# EAGLE design base_drive (EAGLE 9.5.0)
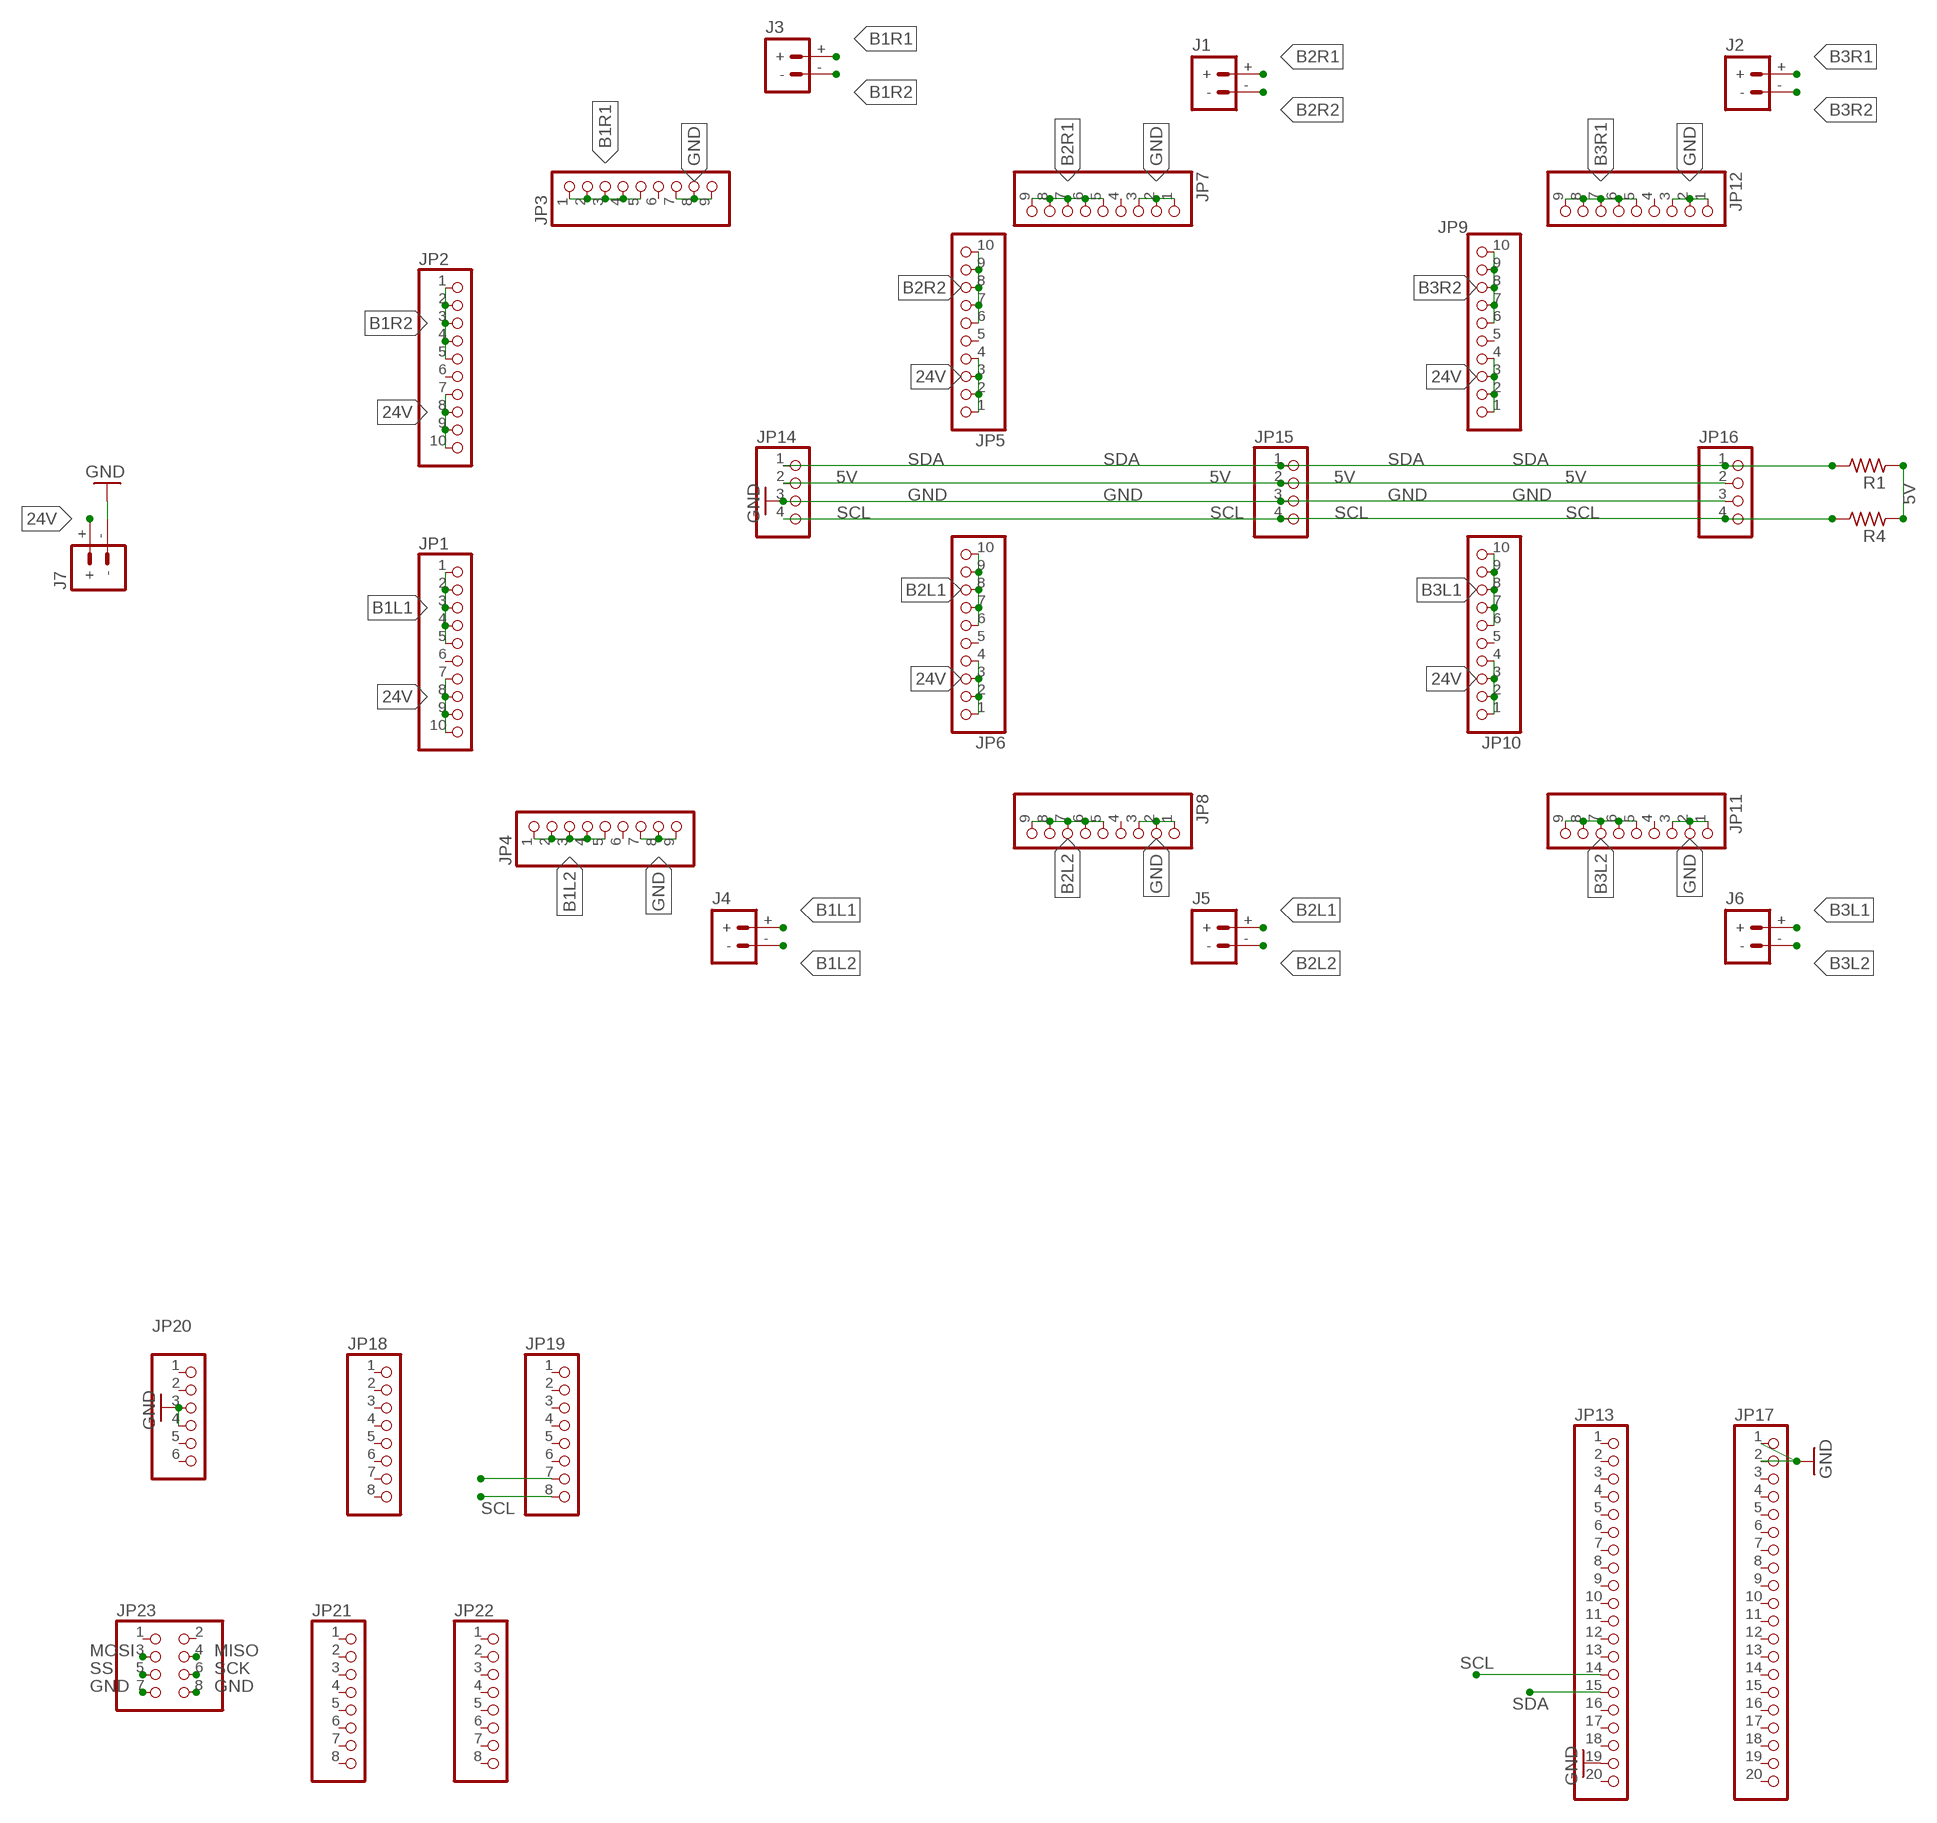
[diagram p0: schematic, sheet 1, part 1 of 2]
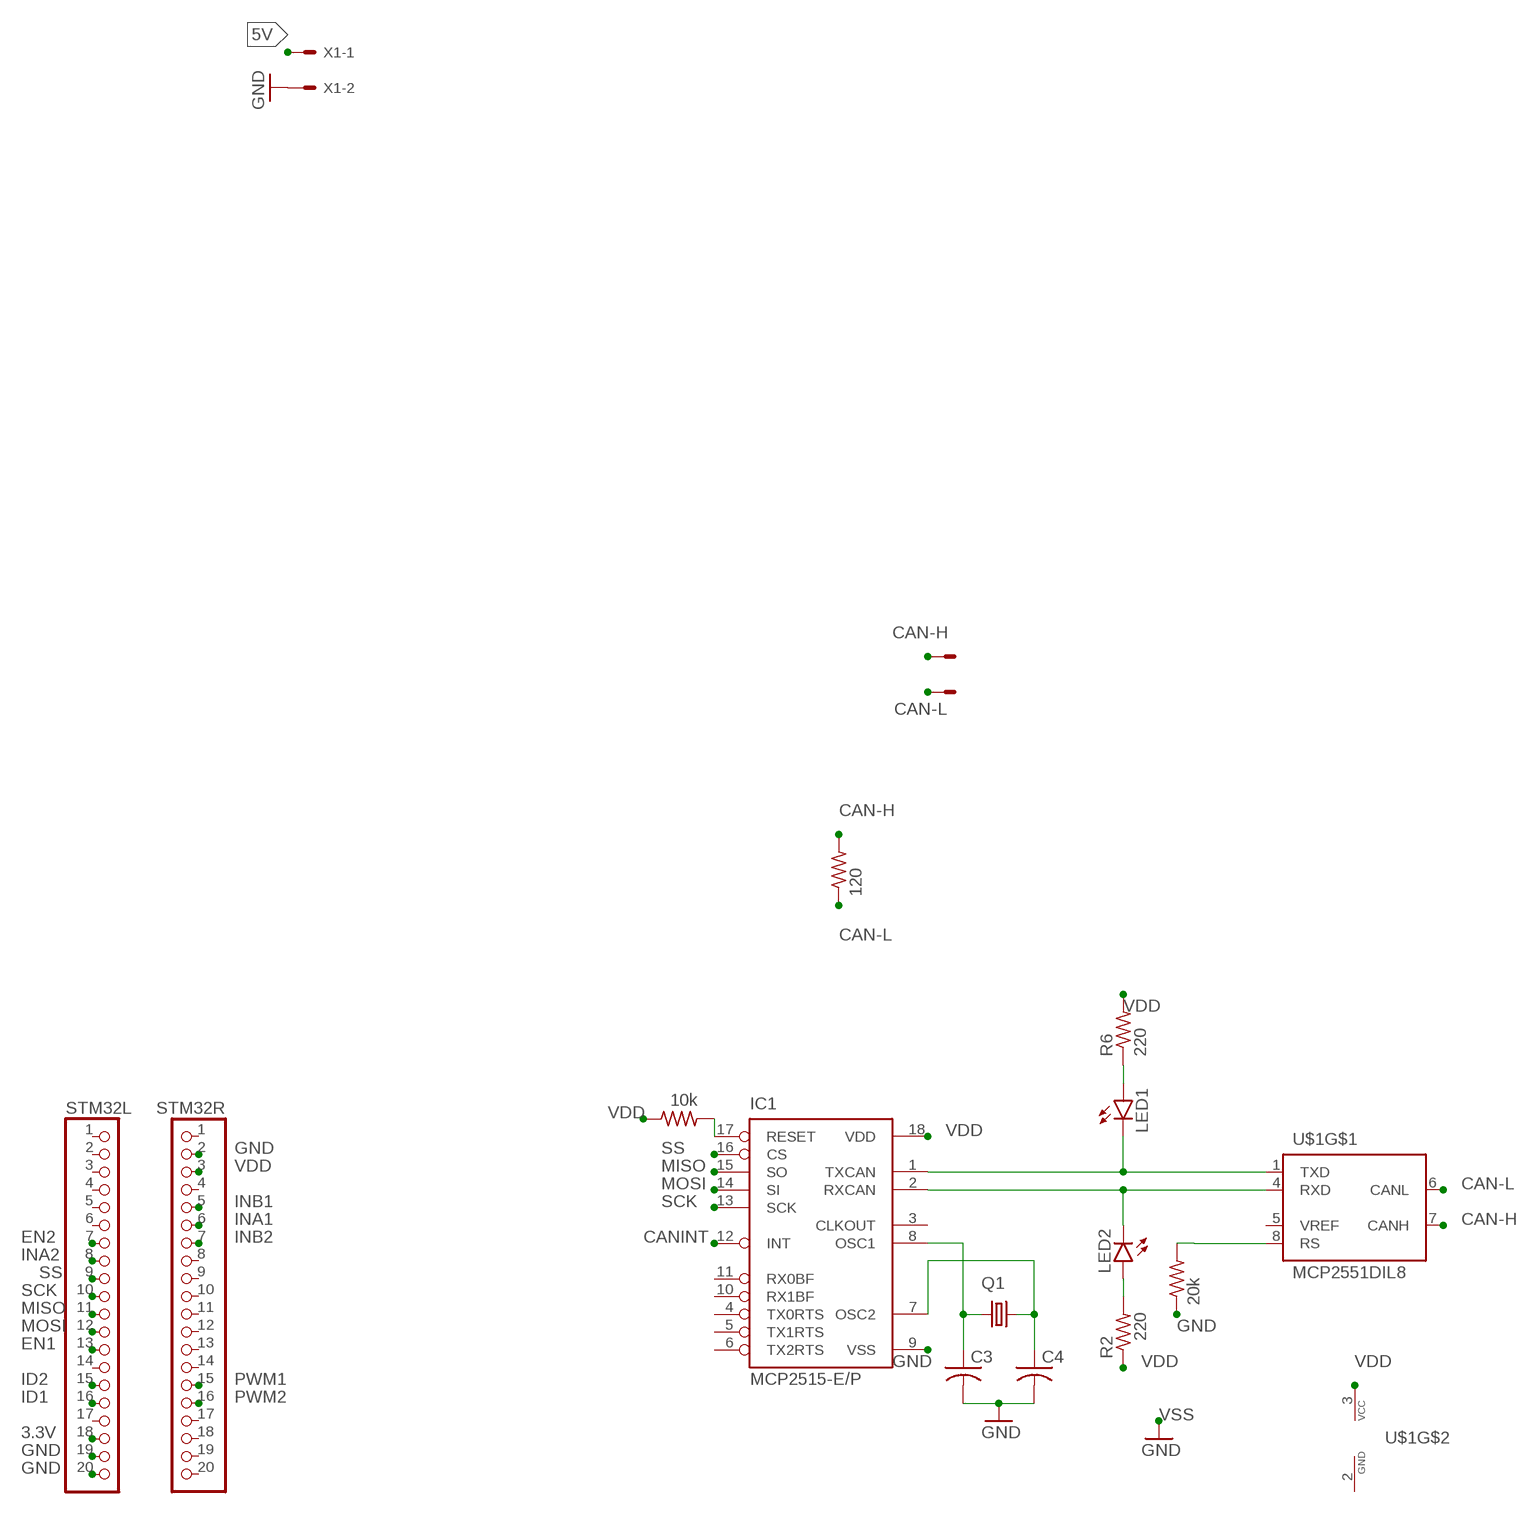
[diagram p1: schematic, sheet 1, part 2 of 2]

## Parts
C3  C-US025-024X044  [C025-024X044]
C4  C-US025-024X044  [C025-024X044]
IC1  MCP2515-E/P  [DIL18]
J1  BATTERY_CONN_DEANS  [DEANS]
J2  BATTERY_CONN_DEANS  [DEANS]
J3  BATTERY_CONN_DEANS  [DEANS]
J4  BATTERY_CONN_DEANS  [DEANS]
J5  BATTERY_CONN_DEANS  [DEANS]
J6  BATTERY_CONN_DEANS  [DEANS]
J7  BATTERY_CONN_DEANS  [DEANS]
JP1  PINHD-1X10  [1X10]
JP2  PINHD-1X10  [1X10]
JP3  PINHD-1X9  [1X09]
JP4  PINHD-1X9  [1X09]
JP5  PINHD-1X10  [1X10]
JP6  PINHD-1X10  [1X10]
JP7  PINHD-1X9  [1X09]
JP8  PINHD-1X9  [1X09]
JP9  PINHD-1X10  [1X10]
JP10  PINHD-1X10  [1X10]
JP11  PINHD-1X9  [1X09]
JP12  PINHD-1X9  [1X09]
JP13  PINHD-1X20  [1X20]
JP14  PINHD-1X4  [1X04]
JP15  PINHD-1X4  [1X04]
JP16  PINHD-1X4  [1X04]
JP17  PINHD-1X20  [1X20]
JP18  PINHD-1X8  [1X08]
JP19  PINHD-1X8  [1X08]
JP20  PINHD-1X6  [1X06]
JP21  PINHD-1X8  [1X08]
JP22  PINHD-1X8  [1X08]
JP23  PINHD-2X4  [2X04]
LED1  LEDSMT1206  [1206]
LED2  LEDSMT1206  [1206]
Q1  CRYSTALHC49U-V  [HC49U-V]
R1  R_1206  [R1206]
R2  220  R-US_R0805  [R0805]
R3  120  R-US_0207/9  [0207/9]
R4  R_1206  [R1206]
R6  220  R-US_R0805  [R0805]
R39  10k  R-US_0207/10  [0207/10]
R40  20k  R-US_0207/10  [0207/10]
STM32L  PINHD-1X20  [1X20]
STM32R  PINHD-1X20  [1X20]
U$1  MCP2551DIL8  [DIL08]
X1  KK-156-2  [KK-156-2]
X2  KK-156-2  [KK-156-2]

## Nets
3.3V: STM32L.18
5V: JP14.2 JP15.2 JP16.2 R1.1 R4.1 X1.1
24V: J7.+ JP1.7 JP1.8 JP1.9 JP1.10 JP2.7 JP2.8 JP2.9 JP2.10 JP5.1 JP5.2 JP5.3 JP5.4 JP6.1 JP6.2 JP6.3 JP6.4 JP9.1 JP9.2 JP9.3 JP9.4 JP10.1 JP10.2 JP10.3 JP10.4
B1L1: J4.+ JP1.1 JP1.2 JP1.3 JP1.4 JP1.5
B1L2: J4.- JP4.1 JP4.2 JP4.3 JP4.4 JP4.5
B1R1: J3.+ JP3.1 JP3.2 JP3.3 JP3.4 JP3.5
B1R2: J3.- JP2.1 JP2.2 JP2.3 JP2.4 JP2.5
B2L1: J5.+ JP6.6 JP6.7 JP6.8 JP6.9 JP6.10
B2L2: J5.- JP8.5 JP8.6 JP8.7 JP8.8 JP8.9
B2R1: J1.+ JP7.5 JP7.6 JP7.7 JP7.8 JP7.9
B2R2: J1.- JP5.6 JP5.7 JP5.8 JP5.9 JP5.10
B3L1: J6.+ JP10.6 JP10.7 JP10.8 JP10.9 JP10.10
B3L2: J6.- JP11.5 JP11.6 JP11.7 JP11.8 JP11.9
B3R1: J2.+ JP12.5 JP12.6 JP12.7 JP12.8 JP12.9
B3R2: J2.- JP9.6 JP9.7 JP9.8 JP9.9 JP9.10
CAN-H: R3.2 U$1.7(CANH) X2.1
CAN-L: R3.1 U$1.6(CANL) X2.2
CANINT: IC1.12(INT)
EN1: STM32L.13
EN2: STM32L.7
GND: C3.2 C4.2 IC1.9(VSS) J7.- JP3.7 JP3.8 JP3.9 JP4.7 JP4.8 JP4.9 JP7.1 JP7.2 JP7.3 JP8.1 JP8.2 JP8.3 JP11.1 JP11.2 JP11.3 JP12.1 JP12.2 JP12.3 JP13.19 JP14.3 JP15.3 JP16.3 JP17.1 JP17.2 JP20.3 JP20.4 JP23.7 JP23.8 R40.1 STM32L.19 STM32L.20 STM32R.2 X1.2
ID1: STM32L.16
ID2: STM32L.15
INA1: STM32R.6
INA2: STM32L.8
INB1: STM32R.5
INB2: STM32R.7
MISO: IC1.15(SO) JP23.4 STM32L.11
MOSI: IC1.14(SI) JP23.3 STM32L.12
N$1: IC1.1(TXCAN) LED1.C U$1.1(TXD)
N$2: R40.2 U$1.8(RS)
N$3: C4.1 IC1.7(OSC2) Q1.2
N$4: C3.1 IC1.8(OSC1) Q1.1
N$9: IC1.17(RESET) R39.2
N$29: LED2.A R2.2
N$37: LED1.A R6.1
N$38: IC1.2(RXCAN) LED2.C U$1.4(RXD)
PWM1: STM32R.15
PWM2: STM32R.16
SCK: IC1.13(SCK) JP23.6 STM32L.10
SCL: JP13.14 JP14.4 JP15.4 JP16.4 JP19.8 R4.2
SDA: JP13.15 JP14.1 JP15.1 JP16.1 JP19.7 R1.2
SS: IC1.16(CS) JP23.5 STM32L.9
VDD: IC1.18(VDD) R2.1 R6.2 R39.1 STM32R.3 U$1.3(VCC)
Unconnected: IC1.3(CLKOUT) IC1.4(TX0RTS) IC1.5(TX1RTS) IC1.6(TX2RTS) IC1.10(RX1BF) IC1.11(RX0BF) JP1.6 JP2.6 JP3.6 JP4.6 JP5.5 JP6.5 JP7.4 JP8.4 JP9.5 JP10.5 JP11.4 JP12.4 JP13.1 JP13.2 JP13.3 JP13.4 JP13.5 JP13.6 JP13.7 JP13.8 JP13.9 JP13.10 JP13.11 JP13.12 JP13.13 JP13.16 JP13.17 JP13.18 JP13.20 JP17.3 JP17.4 JP17.5 JP17.6 JP17.7 JP17.8 JP17.9 JP17.10 JP17.11 JP17.12 JP17.13 JP17.14 JP17.15 JP17.16 JP17.17 JP17.18 JP17.19 JP17.20 JP18.1 JP18.2 JP18.3 JP18.4 JP18.5 JP18.6 JP18.7 JP18.8 JP19.1 JP19.2 JP19.3 JP19.4 JP19.5 JP19.6 JP20.1 JP20.2 JP20.5 JP20.6 JP21.1 JP21.2 JP21.3 JP21.4 JP21.5 JP21.6 JP21.7 JP21.8 JP22.1 JP22.2 JP22.3 JP22.4 JP22.5 JP22.6 JP22.7 JP22.8 JP23.1 JP23.2 STM32L.1 STM32L.2 STM32L.3 STM32L.4 STM32L.5 STM32L.6 STM32L.14 STM32L.17 STM32R.1 STM32R.4 STM32R.8 STM32R.9 STM32R.10 STM32R.11 STM32R.12 STM32R.13 STM32R.14 STM32R.17 STM32R.18 STM32R.19 STM32R.20 U$1.5(VREF)

## Power pins joined to a net without a drawn wire
GND: U$1.2(GND)

## Library data of the parts
C3 C4 = adafruit:C-US: CAPACITOR, American symbol
IC1 = mcp2515:MCP2515
J1-J7 = SparkFun-Connectors:BATTERY_CONN: Battery Connectors Various footprints for battery connections SparkFun Products: Deans Connector -M/F Pair <https://www.sparkfun.com/products/11864>; SF_ID: PRT-11864
JP1 JP2 JP5 JP6 JP9 JP10 = pinhead:PINHD-1X10: PIN HEADER
JP3 JP4 JP7 JP8 JP11 JP12 = pinhead:PINHD-1X9: PIN HEADER
JP13 JP17 = pinhead:PINHD-1X20: PIN HEADER
JP14-JP16 = pinhead:PINHD-1X4: PIN HEADER
JP18 JP19 JP21 JP22 = pinhead:PINHD-1X8: PIN HEADER
JP20 = pinhead:PINHD-1X6: PIN HEADER
JP23 = adafruit:PINHD-2X4: PIN HEADER
LED1 LED2 = led:LED: LED OSRAM: - CHIPLED LG R971, LG N971, LY N971, LG Q971, LY Q971, LO R971, LY R971 LH N974, LH R974 LS Q976, LO Q976, LY Q976 LO Q996 - Hyper CHIPLED LW Q18S LB Q993, LB Q99A, LB R99A - SideLED LS A670, LO A670, LY A670, LG A670, LP A670 LB A673, LV A673, LT A673, LW A673 LH A674 LY A675 LS A676, LA A676, LO A676, LY A676, LW A676 LS A679, LY A679, LG A679 - Hyper Micro SIDELED® LS Y876, LA Y876, LO Y876, LY Y876 LT Y87S - SmartLED LW L88C, LW L88S LB L89C, LB L89S, LG L890 LS L89K, LO L89K, LY L89K LS L896, LA L896, LO L896, LY L896 - TOPLED LS T670, LO T670, LY T670, LG T670, LP T670 LSG T670, LSP T670, LSY T670, LOP T670, LYG T670 LG T671, LOG T671, LSG T671 LB T673, LV T673, LT T673, LW T673 LH T674 LS T676, LA T676, LO T676, LY T676, LB T676, LH T676, LSB T676, LW T676 LB T67C, LV T67C, LT T67C, LS T67K, LO T67K, LY T67K, LW E67C LS E67B, LA E67B, LO E67B, LY E67B, LB E67C, LV E67C, LT E67C LW T67C LS T679, LY T679, LG T679 LS T770, LO T770, LY T770, LG T770, LP T770 LB T773, LV T773, LT T773, LW T773 LH T774 LS E675, LA E675, LY E675, LS T675 LS T776, LA T776, LO T776, LY T776, LB T776 LHGB T686 LT T68C, LB T68C - Hyper Mini TOPLED® LB M676 - Mini TOPLED Santana® LG M470 LS M47K, LO M47K, LY M47K Source: http://www.osram.convergy.de LUXEON: - LUMILED® LXK2-PW12-R00, LXK2-PW12-S00, LXK2-PW14-U00, LXK2-PW14-V00 LXK2-PM12-R00, LXK2-PM12-S00, LXK2-PM14-U00 LXK2-PE12-Q00, LXK2-PE12-R00, LXK2-PE12-S00, LXK2-PE14-T00, LXK2-PE14-U00 LXK2-PB12-K00, LXK2-PB12-L00, LXK2-PB12-M00, LXK2-PB14-N00, LXK2-PB14-P00, LXK2-PB14-Q00 LXK2-PR12-L00, LXK2-PR12-M00, LXK2-PR14-Q00, LXK2-PR14-R00 LXK2-PD12-Q00, LXK2-PD12-R00, LXK2-PD12-S00 LXK2-PH12-R00, LXK2-PH12-S00 LXK2-PL12-P00, LXK2-PL12-Q00, LXK2-PL12-R00 Source: www.luxeon.com KINGBRIGHT: KA-3528ASYC Source: www.kingbright.com
Q1 = adafruit:CRYSTAL: CRYSTAL; OC_FARNELL: 1666969; OC_NEWARK: unknown
R1 R4 = rc-master-smd:R_: RESISTOR
R2 R6 = rcl:R-US_: RESISTOR, American symbol; SPICEPREFIX: R
R3 R39 R40 = adafruit:R-US_: RESISTOR, American symbol
STM32L STM32R = adafruit:PINHD-1X20: PIN HEADER
U$1 = can:MCP2551: CAN Tranceiver Microchip
X1 X2 = con-molex:KK-156-2: KK 156 HEADER Source: http://www.molex.com/pdm_docs/sd/026604100_sd.pdf; MF: MOLEX; OC_FARNELL: unknown; OC_NEWARK: unknown

## Board
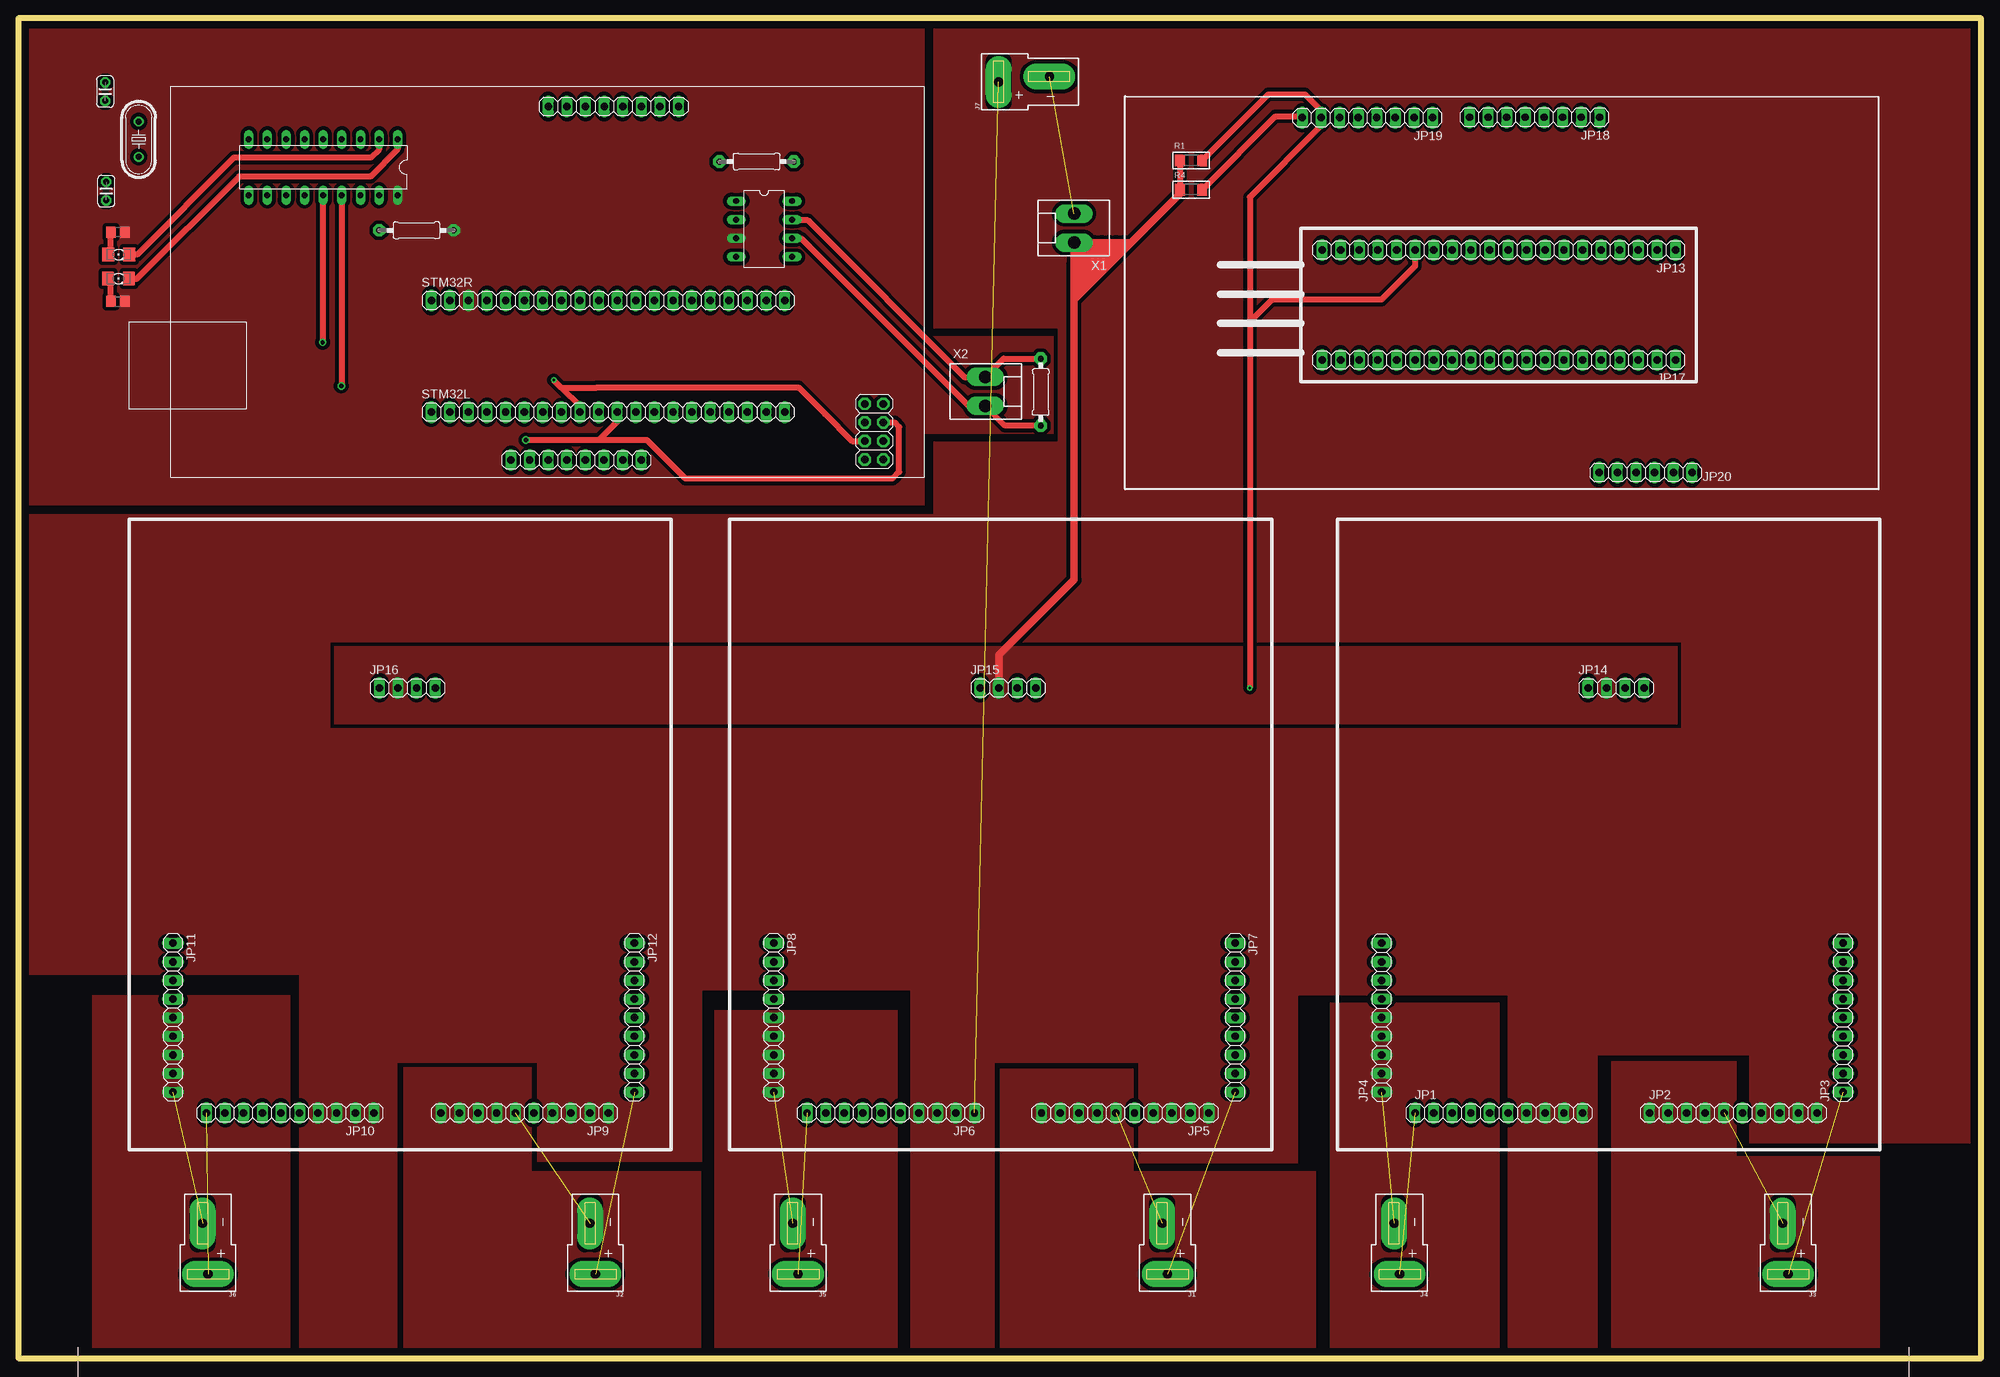
[diagram p2: board, top side]
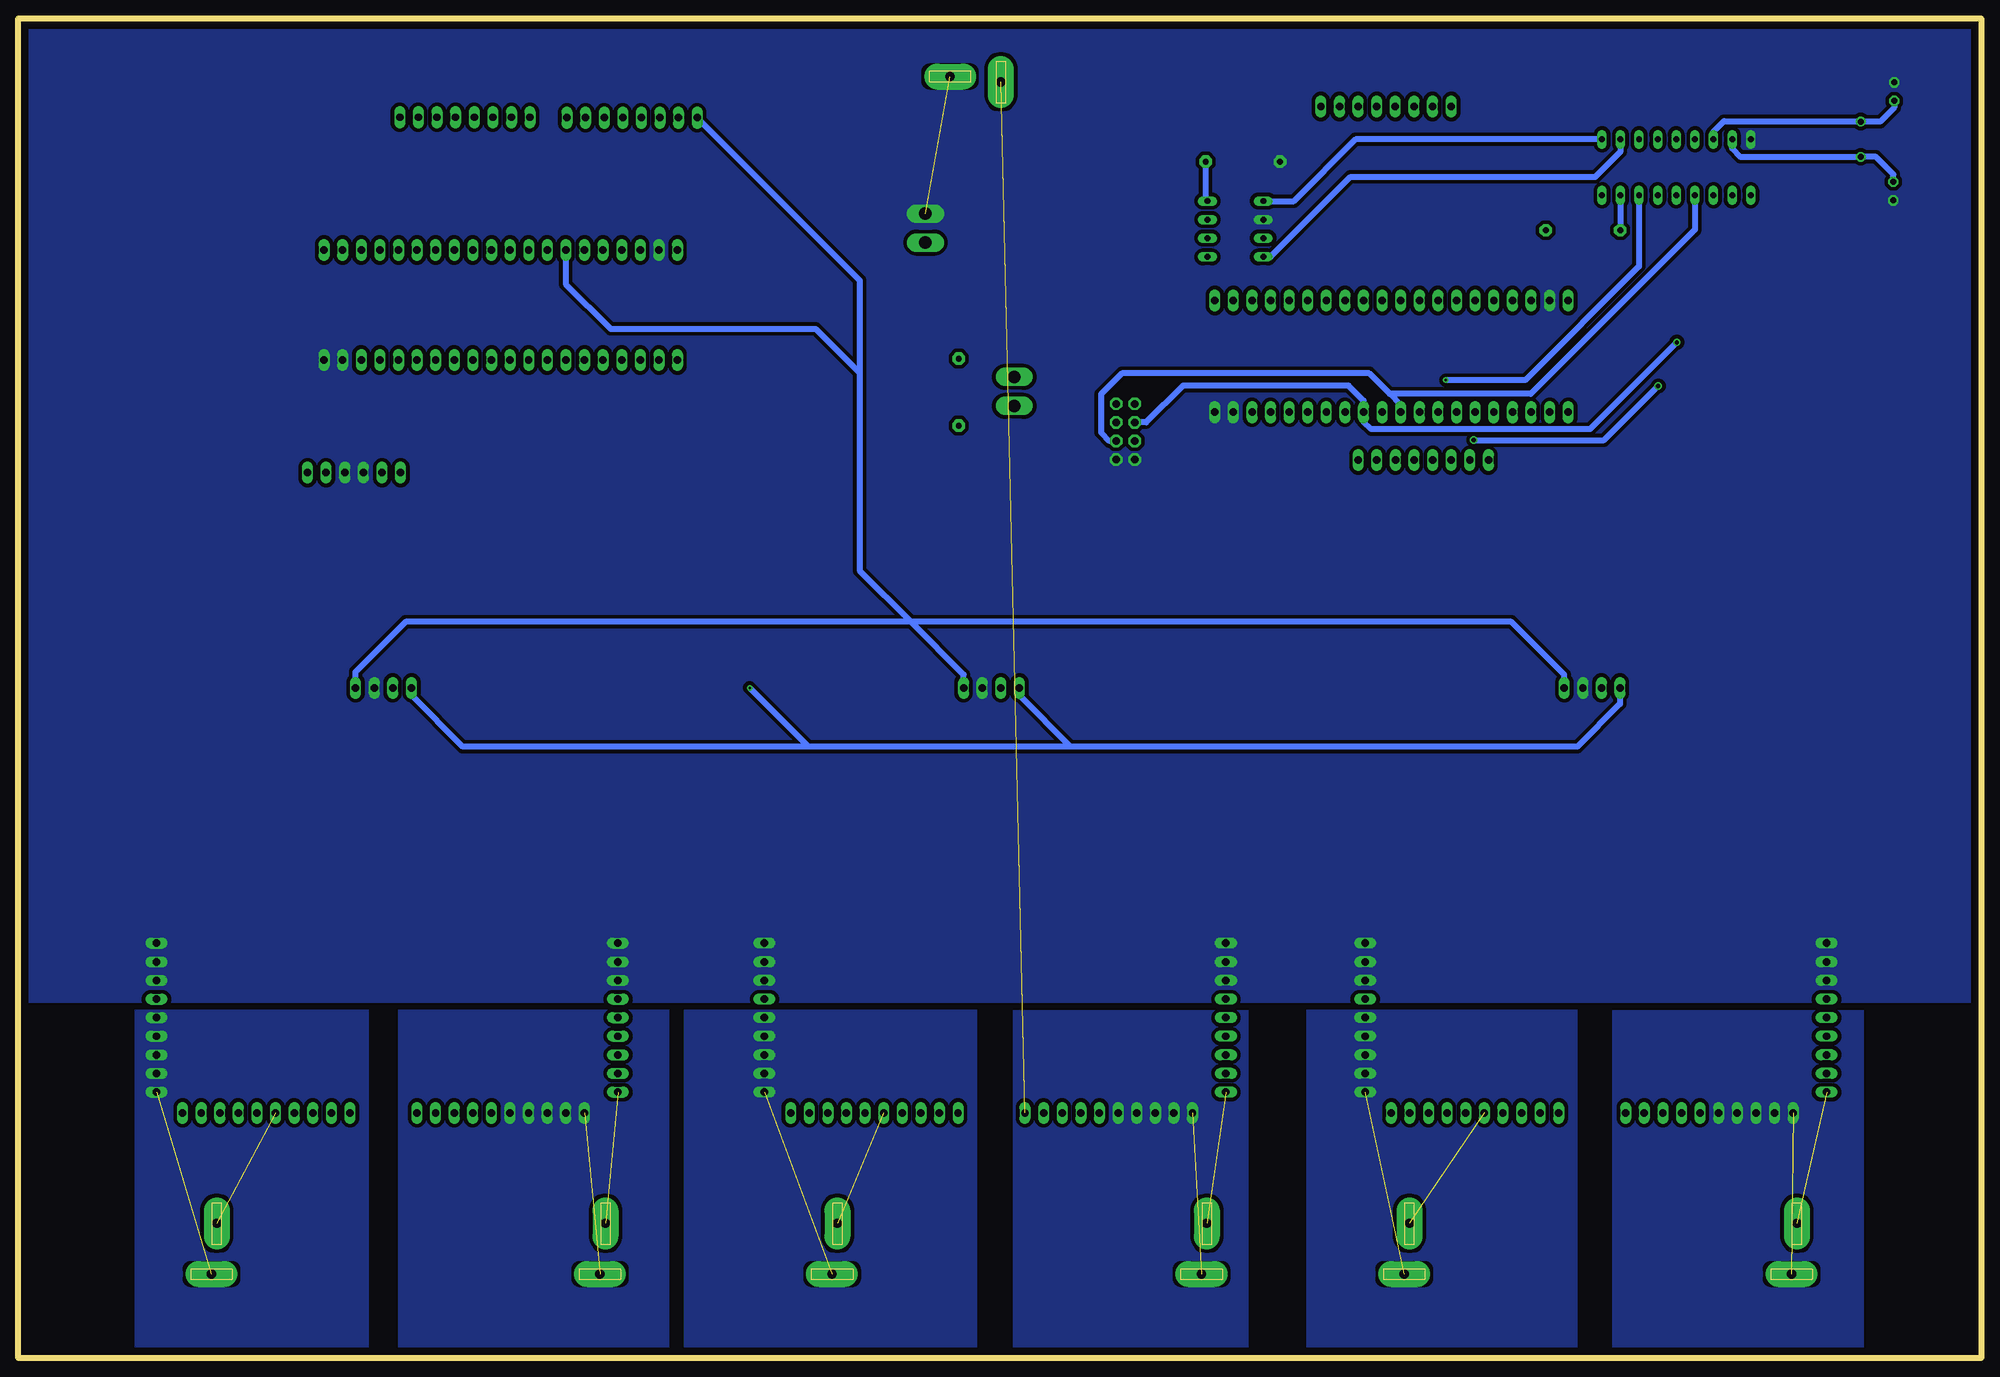
[diagram p3: board, bottom side, seen from below]

Size 267.97 x 182.88 mm. Coordinates in mm from the lower left corner, seen from the top.
Outline: 0,0 267.97,0 267.97,182.88 0,182.88 0,0
Copper layers (1*16): Top 0.035mm / dielectric 1.5mm / Bottom 0.035mm
Design rules "default *": minimum track width 6mil, minimum drill 0.35mm, track to track 20mil, track to pad 20mil, pad to pad 20mil, via to via 20mil, smd to smd 20mil, copper to edge 40mil, drill to drill 6mil, minimum pad ring 10mil, minimum via ring 8mil, stop-mask expansion 4mil, vias tented up to drill 0mil, thermal gap 10mil

### Footprints (pad centres in the part's own frame; a part is rotated, then mirrored left to right if it is on the bottom)
C025-024X044 = drill 0.813 pad 1.422 octagon: 1 -1.27,0; 2 1.27,0
DIL18 = drill 0.813 long: 1 -10.16,-3.81; 2 -7.62,-3.81; 3 -5.08,-3.81; 4 -2.54,-3.81; 5 0,-3.81; 6 2.54,-3.81; 7 5.08,-3.81; 8 7.62,-3.81; 9 10.16,-3.81; 10 10.16,3.81; 11 7.62,3.81; 12 5.08,3.81; 13 2.54,3.81; 14 0,3.81; 15 -2.54,3.81; 16 -5.08,3.81; 17 -7.62,3.81; 18 -10.16,3.81
DEANS = drill 1.27 pad 3.556 long: + 0,0; - 0.737,-6.921
1X10 = drill 1.016 long: 1 -11.43,0; 2 -8.89,0; 3 -6.35,0; 4 -3.81,0; 5 -1.27,0; 6 1.27,0; 7 3.81,0; 8 6.35,0; 9 8.89,0; 10 11.43,0
1X09 = drill 1.016 long: 1 -10.16,0; 2 -7.62,0; 3 -5.08,0; 4 -2.54,0; 5 0,0; 6 2.54,0; 7 5.08,0; 8 7.62,0; 9 10.16,0
1X20 = drill 1.016 long: 1 -24.13,0; 2 -21.59,0; 3 -19.05,0; 4 -16.51,0; 5 -13.97,0; 6 -11.43,0; 7 -8.89,0; 8 -6.35,0; 9 -3.81,0; 10 -1.27,0; 11 1.27,0; 12 3.81,0; 13 6.35,0; 14 8.89,0; 15 11.43,0; 16 13.97,0; 17 16.51,0; 18 19.05,0; 19 21.59,0; 20 24.13,0
1X04 = drill 1.016 long: 1 -3.81,0; 2 -1.27,0; 3 1.27,0; 4 3.81,0
1X08 = drill 1.016 long: 1 -8.89,0; 2 -6.35,0; 3 -3.81,0; 4 -1.27,0; 5 1.27,0; 6 3.81,0; 7 6.35,0; 8 8.89,0
1X06 = drill 1.016 long: 1 -6.35,0; 2 -3.81,0; 3 -1.27,0; 4 1.27,0; 5 3.81,0; 6 6.35,0
2X04 = drill 1.016 pad 1.676 octagon: 1 -3.81,-1.27; 2 -3.81,1.27; 3 -1.27,-1.27; 4 -1.27,1.27; 5 1.27,-1.27; 6 1.27,1.27; 7 3.81,-1.27; 8 3.81,1.27
1206 = smd 1.6 x 1.803: A -1.422,0; C 1.422,0
HC49U-V = drill 0.813: 1 -2.413,0; 2 2.413,0
R1206 = smd 1.3 x 1.6: 1 -1.524,0; 2 1.524,0
R0805 = smd 1.3 x 1.5: 1 -0.95,0; 2 0.95,0
0207/9 = drill 0.813 pad 1.676 octagon: 1 -4.572,0; 2 4.572,0
0207/10 = drill 0.813 pad 1.676 octagon: 1 -5.08,0; 2 5.08,0
DIL08 = drill 0.813 long: 1 -3.81,-3.81; 2 -1.27,-3.81; 3 1.27,-3.81; 4 3.81,-3.81; 5 3.81,3.81; 6 1.27,3.81; 7 -1.27,3.81; 8 -3.81,3.81
KK-156-2 = drill 1.7 pad 2.184 long: 1 -1.98,0; 2 1.98,0

### Placement (x,y rotation side)
C3  12,159.3 270 top
C4  11.87,172.88 90 top
IC1  41.62,162.55 180 top
J1  156.89,11.49 180 top
J2  78.78,11.49 180 top
J3  241.61,11.49 180 top
J4  188.56,11.49 180 top
J5  106.45,11.49 180 top
J6  25.89,11.49 180 top
J7  133.85,174.2 90 top
JP1  202.11,33.49 0 top
JP2  234.11,33.49 0 top
JP3  249.11,46.49 90 top
JP4  186.11,46.49 90 top
JP5  151.11,33.49 180 top
JP6  119.11,33.49 180 top
JP7  166.11,46.49 270 top
JP8  103.11,46.49 270 top
JP9  69.11,33.49 180 top
JP10  37.11,33.49 180 top
JP11  21.11,46.49 270 top
JP12  84.11,46.49 270 top
JP13  202.11,151.25 180 top
JP14  218.11,91.49 0 top
JP15  135.11,91.49 0 top
JP16  53.11,91.49 0 top
JP17  202.11,136.25 180 top
JP18  207,169.38 180 top
JP19  184.19,169.31 180 top
JP20  222.14,120.87 0 top
JP21  81.25,170.85 0 top
JP22  76.16,122.57 0 top
JP23  116.83,126.46 270 top
LED1  13.68,147.37 0 top
LED2  13.7,150.64 0 top
Q1  16.43,166.38 90 top
R1  160.11,163.49 0 top
R2  13.63,153.68 180 top
R3  139.58,131.87 90 top
R4  160.11,159.49 0 top
R6  13.58,144.24 0 top
R39  54.37,153.95 180 top
R40  100.79,163.32 0 top
STM32L  80.5,129.12 0 top
STM32R  80.5,144.37 0 top
U$1  101.82,154.13 270 top
X1  144.13,154.25 90 top
X2  132.01,131.97 270 top

### Tracks (layer width: path | path; a pad name or v marks a point on that pad's centre or on a via)
5V
  Top 0.813: R1.1 R4.1
  Top 1.016: JP15.2 133.87,91.52 133.87,95.99 144.13,106.25 144.13,144.49 | 144.13,150.49 X1.1 145.92,152.28 | 144.13,150.49 144.13,149.49 | 144.13,144.49 144.13,145.49 | 144.13,145.49 144.13,146.49 | 144.13,146.49 144.13,147.49 | 144.13,147.49 144.13,148.49 | 144.13,148.49 144.13,149.49 | 145.92,152.28 146.92,152.28 | 146.92,152.28 148.92,152.28 | 148.92,152.28 149.92,152.28 | 149.92,152.28 150.92,152.28 | 144.13,150.49 145.92,152.28 | 144.13,149.49 146.92,152.28 | 144.13,148.49 147.92,152.28 | 144.13,147.49 148.92,152.28 | 144.13,146.49 149.92,152.28 | 144.13,145.49 150.92,152.28 | 144.13,144.49 151.85,152.21 | 150.92,152.28 151.89,152.28 158.59,158.97 R4.1
  pour Top (no thermals): 43.11,97.14 43.11,86.57 226.49,86.57 226.49,97.14
24V  (1 unrouted)
  pour Top (rank 2, no thermals): 124.95,190.09 124.95,140.62 141.96,140.62 141.96,125.01 124.95,125.01 124.95,115.16 -9.99,115.16 -9.99,52.42 38.31,52.42 38.31,-6.3 51.73,-6.3 51.73,40.42 70.84,40.42 70.84,26.89 93.36,26.89 93.36,50.29 121.77,50.29 121.77,-3.2 133.29,-3.2 133.29,40.42 152.89,40.42 152.89,26.7 174.69,26.7 174.69,49.64 203.32,49.64 203.32,-4.57 215.58,-4.57 215.58,41.41 236.33,41.41 236.33,29.43 316.03,29.43 316.03,190.09
B1L1  (1 unrouted)
  pour Bottom (no thermals): 216.11,47.49 216.11,-6.51 179.11,-6.51 179.11,47.49
B1L2  (1 unrouted)
  pour Top (no thermals): 179.11,-3.42 179.11,48.49 202.11,48.49 202.11,-3.42
B1R1  (1 unrouted)
  pour Bottom (no thermals): 220.11,47.49 252.11,47.49 252.11,-6.51 220.11,-6.51
B1R2  (1 unrouted)
  pour Top (no thermals): 217.48,-4.66 254.11,-4.66 254.11,27.49 234.57,27.49 234.57,40.49 217.48,40.49
B2L1  (1 unrouted)
  pour Bottom (no thermals): 100.11,47.49 100.11,-9.51 132.11,-9.51 132.11,47.49
B2L2  (1 unrouted)
  pour Top (no thermals): 95.11,47.49 119.97,47.49 119.97,-5.59 95.11,-5.59
B2R1  (1 unrouted)
  pour Bottom (no thermals): 137.11,47.49 177.11,47.49 177.11,-6.51 137.11,-6.51
B2R2  (1 unrouted)
  pour Top (no thermals): 134.11,39.49 152.14,39.49 152.14,25.49 177.11,25.49 177.11,-9.41 134.11,-9.41
B3L1  (1 unrouted)
  pour Bottom (no thermals): 16.11,47.49 16.11,-0.51 50.27,-0.51 50.27,47.49
B3L2  (1 unrouted)
  pour Top (no thermals): 10.11,49.49 10.11,-5.51 37.11,-5.51 37.11,49.49
B3R1  (1 unrouted)
  pour Bottom (no thermals): 55.14,47.49 92.11,47.49 92.11,-8.51 55.14,-8.51
B3R2  (1 unrouted)
  pour Top (no thermals): 52.66,-6.59 52.66,39.72 70,39.72 70,25.49 93.11,25.49 93.11,-6.59
CAN-H
  Top 0.813: U$1.7 105.72,155.31 107.81,155.31 129.26,133.86 131.92,133.86 X2.1 134.5,136.44 R3.2
CAN-L
  Top 0.813: U$1.6 105.7,152.8 106.92,152.8 129.73,129.99 X2.2 134.71,127.29 R3.1
GND  (1 unrouted)
  pour Bottom (rank 2, no thermals): -17.89,48.49 302.11,48.49 302.11,190.49 -17.89,190.49
MISO  (via drill 0.6)
  Top 0.813: IC1.15 44.16,132.78 v44.09,132.7 | v69.28,125.34 79.26,125.34 | STM32L.11 81.77,127.85 79.26,125.34 | JP23.4 119.61,127.73 120.24,127.1 120.24,120.97 119.33,120.05 91.07,120.05 85.78,125.34 79.26,125.34
  Bottom 0.813: v69.28,125.34 69.25,125.31 51.49,125.31 v44.09,132.7
MOSI  (via drill 0.6)
  Top 0.813: v41.55,138.66 v41.56,138.67 41.56,158.68 IC1.14
  Bottom 0.813: 41.55,138.65 v41.55,138.66 53.42,126.8 83.27,126.8 84.31,127.84 STM32L.12 84.31,130.69 86.38,132.76 108.97,132.76 114,127.73 JP23.3
N$1
  Top 0.813: IC1.1 51.78,164.99 48.08,161.29 30.13,161.29 16.12,147.28 15.19,147.28 LED1.C
  Bottom 0.813: U$1.1 93.84,157.94 85.42,166.36 IC1.1
N$2
  Bottom 0.813: R40.2 105.87,158.19 U$1.8
N$3
  Bottom 0.813: IC1.7 36.55,167.43 35.13,168.84 16.48,168.84 Q1.2 13.78,168.79 11.87,170.7 C4.1
N$4
  Bottom 0.813: IC1.8 34.01,165.12 32.85,163.97 Q1.1 14.38,163.97 12,161.59 C3.1
N$9
  Bottom 0.813: IC1.17 49.24,154 R39.2
N$29
  Top 0.813: R2.2 12.61,153.68 12.55,153.62 12.55,150.44 12.48,150.44 LED2.A
N$37
  Top 0.813: LED1.A 12.55,147.07 12.55,144.24 R6.1
N$38
  Top 0.813: IC1.2 49.24,164.96 48.13,163.85 29.43,163.85 16.22,150.64 LED2.C
  Bottom 0.813: U$1.4 97.01,150.32 86.1,161.24 52.7,161.24 49.24,164.69 IC1.2
SCK
  Bottom 0.5: 39.09,154.03 39.37,153.75
  Bottom 0.813: 80.75,131.62 61.5,131.62 39.37,153.75 39.2,153.92 | 80.75,131.62 83.55,134.42 117.33,134.42 120.15,131.59 120.15,126.36 118.99,125.19 JP23.6 | 80.75,131.62 79.23,130.1 STM32L.10 | IC1.13 39.09,154.03
SCL
  Top 0.508: 175.12,169.49 JP19.8 | JP19.8 175.3,169.18 | JP19.8 175.11,169.13
  Top 0.813: R4.2 171.63,169.49 175.12,169.49
  Bottom 0.508: 193.22,150.49 193.22,150.25
  Bottom 0.813: 193.22,150.49 JP13.14 193.22,146.6 187.11,140.49 159.11,140.49 153.11,134.49 | JP19.8 153.11,147.13 153.11,134.49 | 153.11,134.49 153.11,107.49 146.11,100.49 | JP16.4 56.92,93.3 64.11,100.49 146.11,100.49 | 146.11,100.49 215.11,100.49 221.92,93.68 JP14.4 | JP15.4 138.92,93.3 146.11,100.49
SDA  (via drill 0.35)
  Top 0.508: 177.83,170.31 JP19.7
  Top 0.813: R1.2 170.63,172.49 175.66,172.49 177.83,170.31 | JP19.7 177.83,168.22 168.11,158.49 168.11,141.49 | JP13.15 190.68,149.06 186.11,144.49 171.11,144.49 168.11,141.49 | 168.11,141.49 v168.11,91.49
  Bottom 0.813: JP16.1 49.3,89.3 55.11,83.49 124.3,83.49 | 124.3,83.49 160.11,83.49 | 160.11,83.49 207.3,83.49 214.3,90.49 JP14.1 | JP15.1 131.3,90.49 124.3,83.49 | v168.11,91.49 160.11,83.49
SS  (via drill 0.35)
  Top 0.813: v73.11,133.49 74.11,132.49 | 74.11,132.49 76.69,129.91 STM32L.9 | JP23.5 113.84,125.19 110.13,128.9 110.13,128.89 106.52,132.5 78.98,132.5 78.97,132.49 74.11,132.49
  Bottom 0.813: IC1.16 46.7,149.03 62.25,133.49 v73.11,133.49
VDD
  pour Top (no thermals): -10.89,192.62 123.68,192.62 123.68,139.46 141.25,139.46 141.25,126.15 123.68,126.15 123.68,116.43 -10.89,116.43